# Altium schematic sheet PE2.SchDoc
size A4
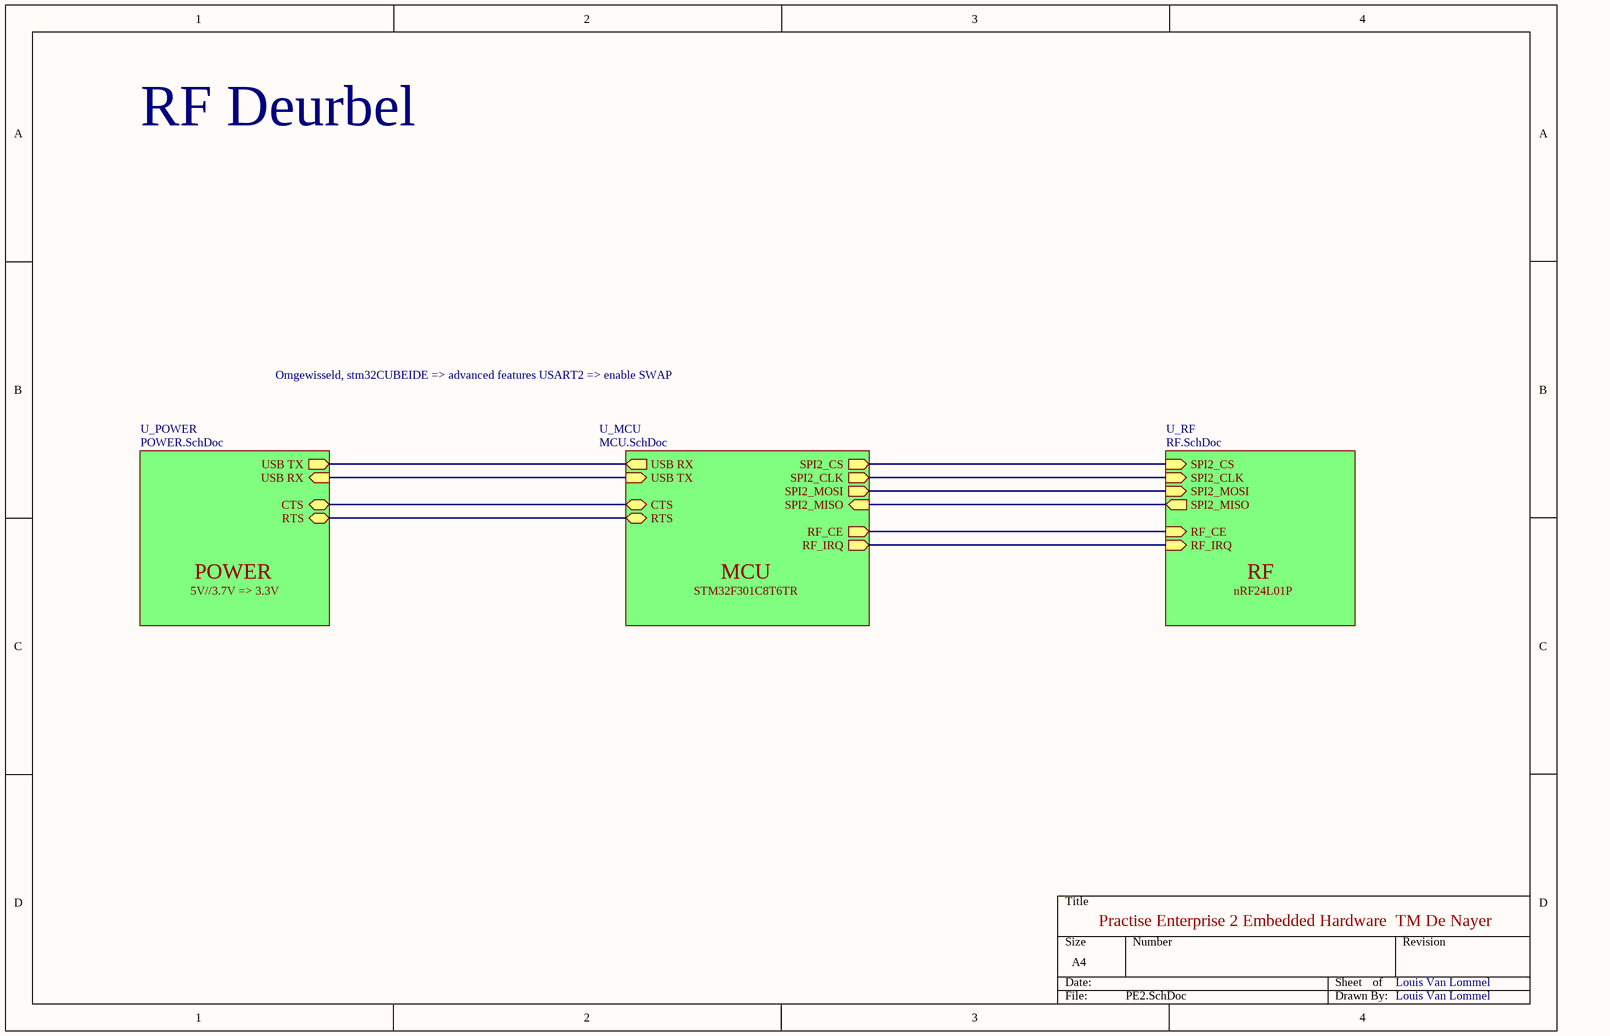
[diagram p0: PE2.SchDoc]

## Sub-sheets
U_MCU = MCU.SchDoc: SPI2_CS (out), SPI2_CLK (out), SPI2_MISO (in), SPI2_MOSI (out), RF_CE (out), RF_IRQ (out), USB RX (out), USB TX (in), CTS (bidir), RTS (bidir)
U_POWER = POWER.SchDoc: USB TX (out), USB RX (in), CTS (bidir), RTS (bidir)
U_RF = RF.SchDoc: SPI2_MOSI (in), SPI2_MISO (out), SPI2_CLK (in), SPI2_CS (in), RF_CE (in), RF_IRQ (in)

## Nets
(unnamed): sheet U_POWER/USB TX, sheet U_MCU/USB RX
(unnamed): sheet U_POWER/USB RX, sheet U_MCU/USB TX
(unnamed): sheet U_POWER/CTS, sheet U_MCU/CTS
(unnamed): sheet U_POWER/RTS, sheet U_MCU/RTS
(unnamed): sheet U_RF/SPI2_MOSI, sheet U_MCU/SPI2_MOSI
(unnamed): sheet U_RF/SPI2_MISO, sheet U_MCU/SPI2_MISO
(unnamed): sheet U_RF/SPI2_CLK, sheet U_MCU/SPI2_CLK
(unnamed): sheet U_RF/SPI2_CS, sheet U_MCU/SPI2_CS
(unnamed): sheet U_RF/RF_CE, sheet U_MCU/RF_CE
(unnamed): sheet U_RF/RF_IRQ, sheet U_MCU/RF_IRQ

## Notes on the sheet
- RF Deurbel
- Omgewisseld, stm32CUBEIDE => advanced features USART2 => enable SWAP
- POWER
- MCU
- RF
- 5V//3.7V => 3.3V
- STM32F301C8T6TR
- nRF24L01P
- Practise Enterprise 2 Embedded Hardware  TM De Nayer
- Louis Van Lommel